# EAGLE design LilyPad-Simple-v25 (EAGLE 6.4)
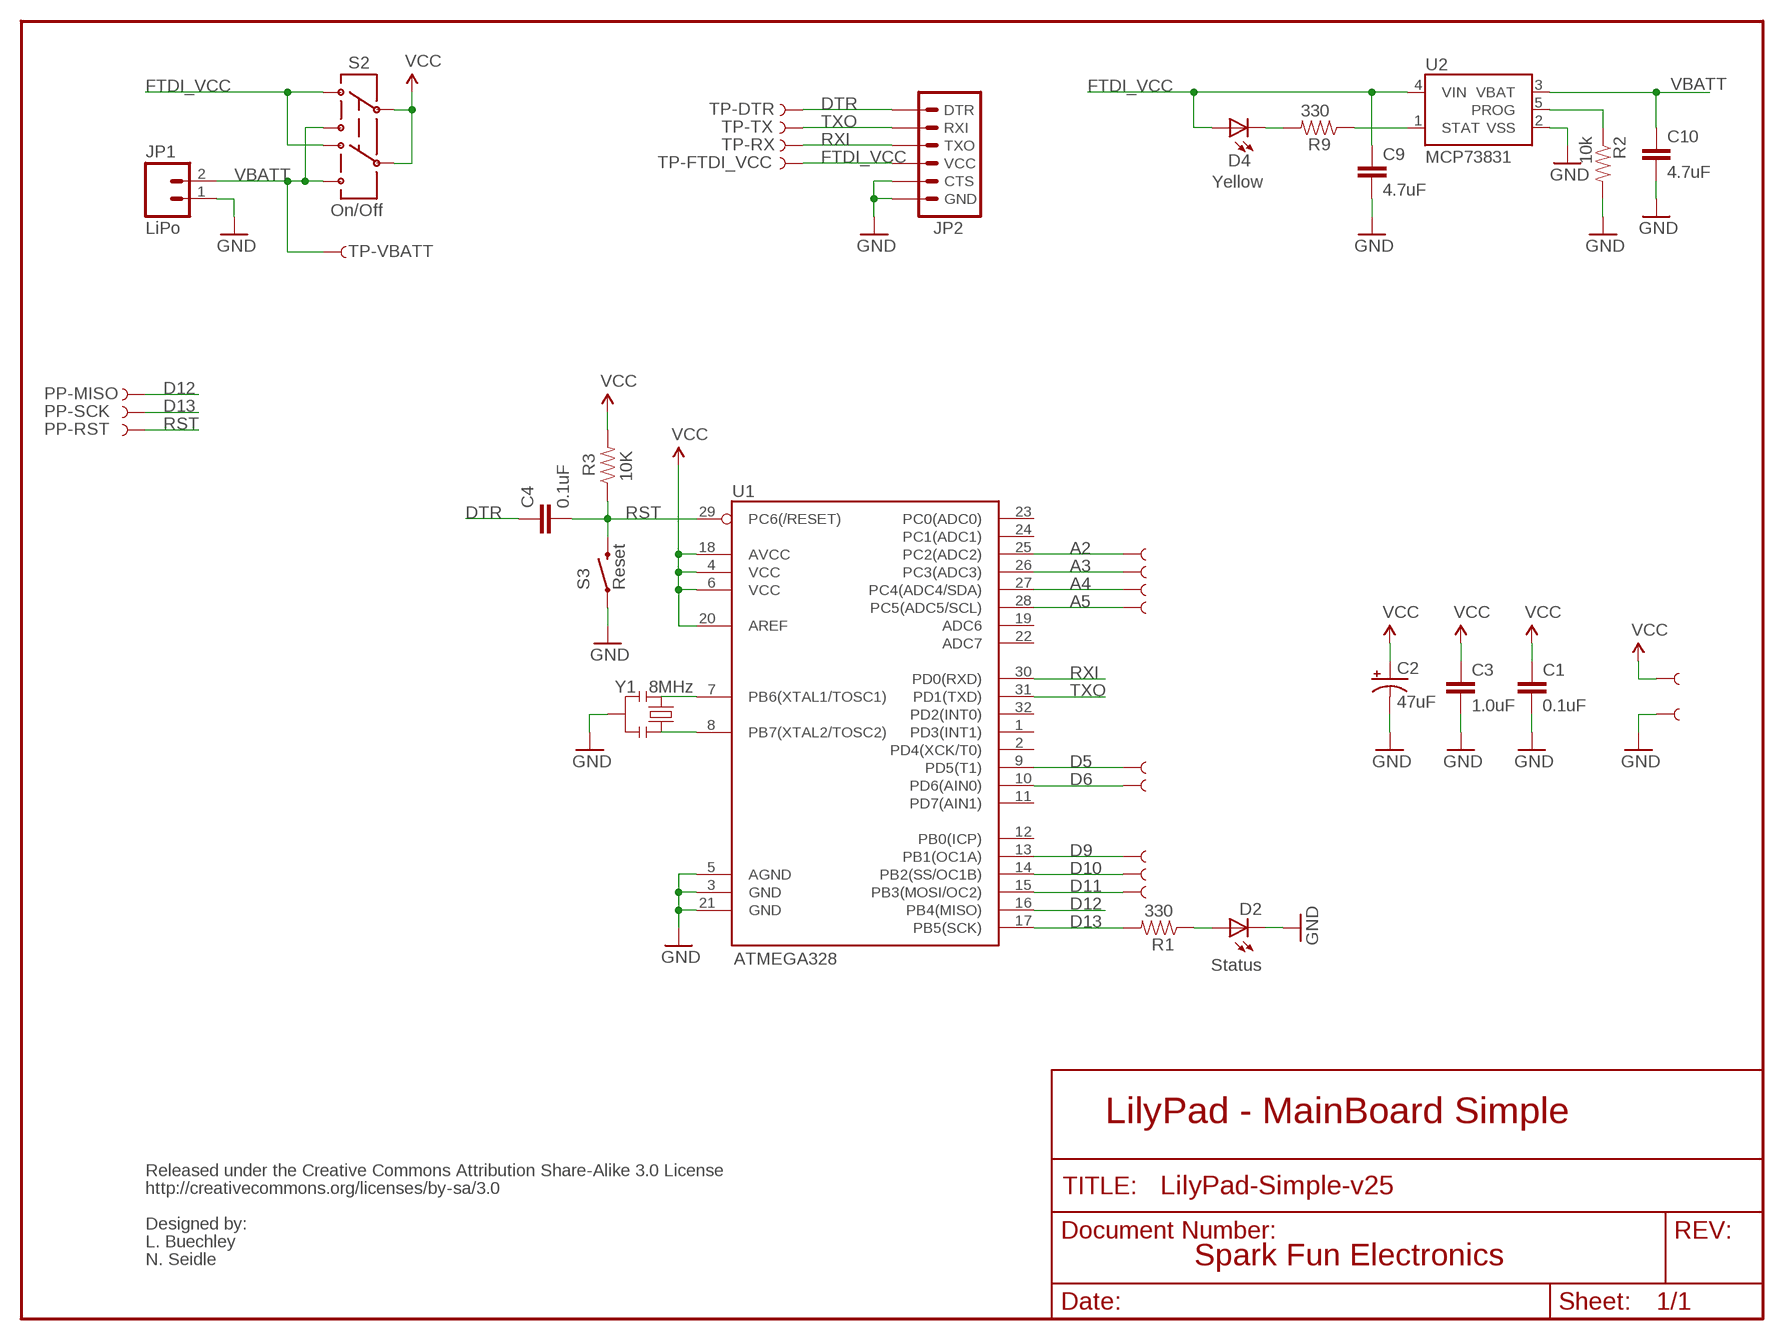
[diagram p0: schematic, sheet 1]

## Parts
A2/16  SEWTAP9  [PETAL-LONG-1-2SIDE]
A3/17  SEWTAP9  [PETAL-LONG-1-2SIDE]
A4/18  SEWTAP9  [PETAL-LONG-1-2SIDE]
A5/19  SEWTAP9  [PETAL-LONG-1-2SIDE]
C1  0.1uF  CAP0402-CAP  [0402-CAP]
C2  47uF  CAP_POL3528  [EIA3528]
C3  1.0uF  CAP0402-CAP  [0402-CAP]
C4  0.1uF  CAP0402-CAP  [0402-CAP]
C9  4.7uF  CAP0402-CAP  [0402-CAP]
C10  4.7uF  CAP0402-CAP  [0402-CAP]
D2  Status  LED0603  [LED-0603]
D4  Yellow  LED0603  [LED-0603]
JP1  LiPo  M02-JST-2MM-SMT  [JST-2-SMD]
JP2  ARDUINO_SERIAL_PROGRAMSMD  [1X06-SMD]
PP-MISO  TEST-POINT3X5  [PAD.03X.05]
PP-RST  TEST-POINT3X5  [PAD.03X.05]
PP-SCK  TEST-POINT3X5  [PAD.03X.05]
R1  330  RESISTOR0402-RES  [0402-RES]
R2  10k  RESISTOR0402-RES  [0402-RES]
R3  10K  RESISTOR0402-RES  [0402-RES]
R9  330  RESISTOR0402-RES  [0402-RES]
S2  On/Off  AYZ0202  [AYZ0202]
S3  Reset  SWITCH-MOMENTARY-2SMD  [TACTILE_SWITCH_SMD]
TP-DTR  TEST-POINT3X5  [PAD.03X.05]
TP-FTDI_VCC  TEST-POINT3X5  [PAD.03X.05]
TP-RX  TEST-POINT3X5  [PAD.03X.05]
TP-TX  TEST-POINT3X5  [PAD.03X.05]
TP-VBATT  TEST-POINT3X5  [PAD.03X.05]
U1  ATMEGA328  ATMEGA168  [TQFP32-08]
U2  MCP73831  [SOT23-5]
U$4  SEWTAP9  [PETAL-LONG-1-2SIDE]
U$35  SEWTAP9  [PETAL-LONG-1-2SIDE]
U$37  SEWTAP9  [PETAL-LONG-1-2SIDE]
U$39  SEWTAP9  [PETAL-LONG-1-2SIDE]
U$41  SEWTAP9  [PETAL-LONG-1-2SIDE]
U$43  SEWTAP9  [PETAL-LONG-1-2SIDE]
U$45  SEWTAP9  [PETAL-LONG-1-2SIDE]
Y1  8MHz  RESONATORSMD  [RESONATOR-SMD]

## Nets
A2: A2/16.1 U1.25(PC2(ADC2))
A3: A3/17.1 U1.26(PC3(ADC3))
A4: A4/18.1 U1.27(PC4(ADC4/SDA))
A5: A5/19.1 U1.28(PC5(ADC5/SCL))
D5: U1.9(PD5(T1)) U$41.1
D6: U1.10(PD6(AIN0)) U$35.1
D9: U1.13(PB1(OC1A)) U$37.1
D10: U1.14(PB2(SS/OC1B)) U$39.1
D11: U1.15(PB3(MOSI/OC2)) U$4.1
D12: PP-MISO.P$1 U1.16(PB4(MISO))
D13: PP-SCK.P$1 R1.2 U1.17(PB5(SCK))
DTR: C4.1 JP2.1(DTR) TP-DTR.P$1
FTDI_VCC: C9.1 D4.A JP2.4(VCC) S2.3 S2.6 TP-FTDI_VCC.P$1 U2.4(VIN)
GND [VCC]: C1.2 C2.C(-) C3.2 C9.2 C10.2 D2.C JP1.1 JP2.5(CTS) JP2.6(GND) R2.2 S3.1 U1.3(GND) U1.5(AGND) U1.21(GND) U2.2(VSS) U$43.1 Y1.2
N$1: U1.7(PB6(XTAL1/TOSC1)) Y1.1
N$2: D2.A R1.1
N$3: U1.8(PB7(XTAL2/TOSC2)) Y1.3
N$8: D4.C R9.2
PROG: R2.1 U2.5(PROG)
RST: C4.2 PP-RST.P$1 R3.1 S3.3 U1.29(PC6(/RESET))
RXI: JP2.3(TXO) TP-RX.P$1 U1.30(PD0(RXD))
STAT: R9.1 U2.1(STAT)
TXO: JP2.2(RXI) TP-TX.P$1 U1.31(PD1(TXD))
VBATT: C10.1 JP1.2 S2.1 S2.4 TP-VBATT.P$1 U2.3(VBAT)
VCC [VCC]: C1.1 C2.A(+) C3.1 R3.2 S2.2 S2.5 U1.4(VCC) U1.6(VCC) U1.18(AVCC) U1.20(AREF) U$45.1
Unconnected: U1.1(PD3(INT1)) U1.2(PD4(XCK/T0)) U1.11(PD7(AIN1)) U1.12(PB0(ICP)) U1.19(ADC6) U1.22(ADC7) U1.23(PC0(ADC0)) U1.24(PC1(ADC1)) U1.32(PD2(INT0))

## Notes on the sheet
- LilyPad - MainBoard Simple
- Released under the Creative Commons Attribution Share-Alike 3.0 License
- http://creativecommons.org/licenses/by-sa/3.0
- Designed by:
- L. Buechley
- N. Seidle | Spark Fun Electronics

## Library data of the parts
A2/16 A3/17 A4/18 A5/19 U$4 U$35 U$37 U$39 U$41 U$43 U$45 = LilyPad-Wearables:SEWTAP
C1 C3 C4 C9 C10 = SparkFun:CAP: Capacitor Standard 0603 ceramic capacitor, and 0.1" leaded capacitor.
C2 = SparkFun:CAP_POL: Capacitor Polarized These are standard SMD and PTH capacitors. Normally 10uF, 47uF, and 100uF in electrolytic and tantalum varieties. Always verify the external diameter of the through hole cap, it varies with capacity, voltage, and manufacturer. The EIA devices should be standard.
D2 D4 = SparkFun:LED: LEDs Standard schematic elements and footprints for 5mm, 3mm, 1206, and 0603 sized LEDs. 5mm - Spark Fun Electronics SKU : COM-00529 (and others)
JP1 = SparkFun:M02: Header 2 Standard 2-pin 0.1" header. Use with straight break away headers (SKU : PRT-00116), right angle break away headers (PRT-00553), swiss pins (PRT-00743), machine pins (PRT-00117), and female headers (PRT-00115). Molex polarized connector foot print use with SKU : PRT-08233 with associated crimp pins and housings.
JP2 = SparkFun:ARDUINO_SERIAL_PROGRAM
PP-MISO PP-RST PP-SCK TP-DTR TP-FTDI_VCC TP-RX TP-TX TP-VBATT = SparkFun:TEST-POINT
R1-R3 R9 = SparkFun:RESISTOR: Resistor Basic schematic elements and footprints for 0603, 1206, and PTH resistors.
S2 = SparkFun:AYZ0202: SPDT Slide Switch Simple SMD single-pull double-throw slide switch. Good for less than 350mA power switch, switching UARTs between devices, etc. Spark Fun Electronics SKU : COM-00597
S3 = SparkFun:SWITCH-MOMENTARY-2
U1 = SparkFun:ATMEGA168
U2 = SparkFun:MCP73831: Microchip's MCP73831 Miniature single cell, fully integrated Li-Ion, Li-polymer charge management controller http://ww1.microchip.com/downloads/en/DeviceDoc/21984a.pdf
Y1 = SparkFun:RESONATOR: Resonator Small SMD resonator. This is the itty bitty 10/20MHz resonators with built in caps. CSTCE10M0G55 and CSTCE20M0V53. Footprint has been reviewed closely but hasn't been tested yet.

## Net classes
0 Default: width 0.203 mm
1 VCC: width 0.254 mm

## Board
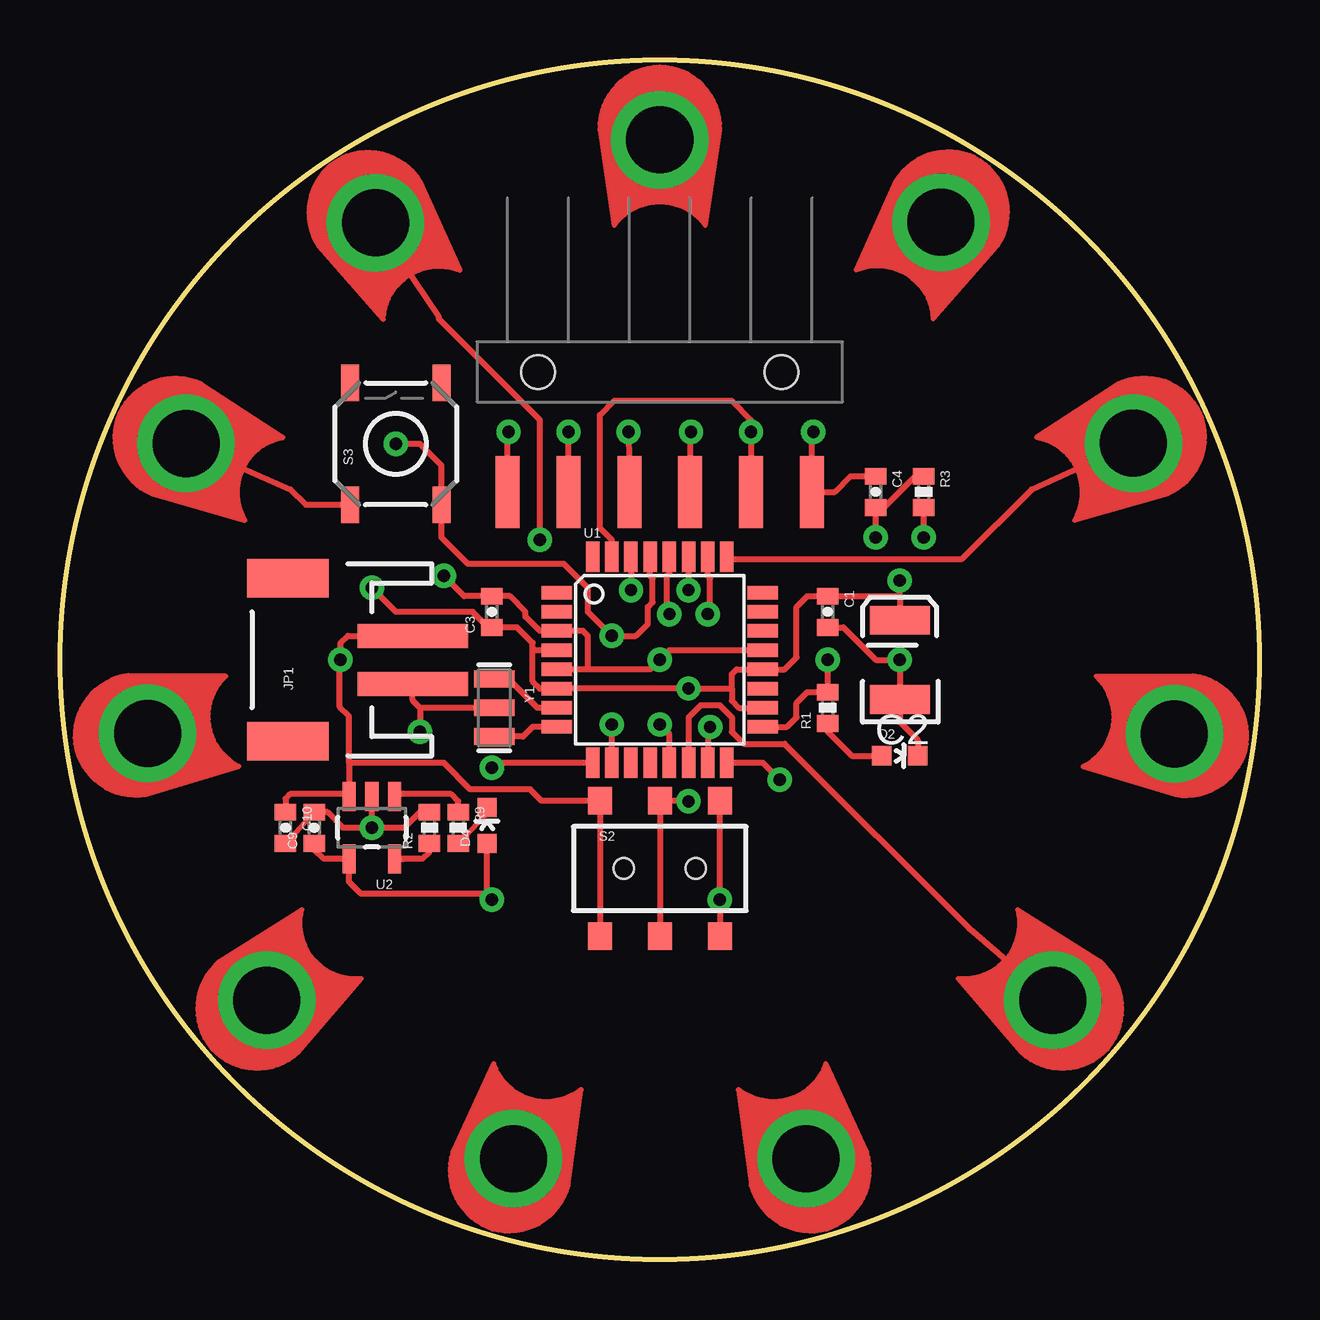
[diagram p1: board, top side]
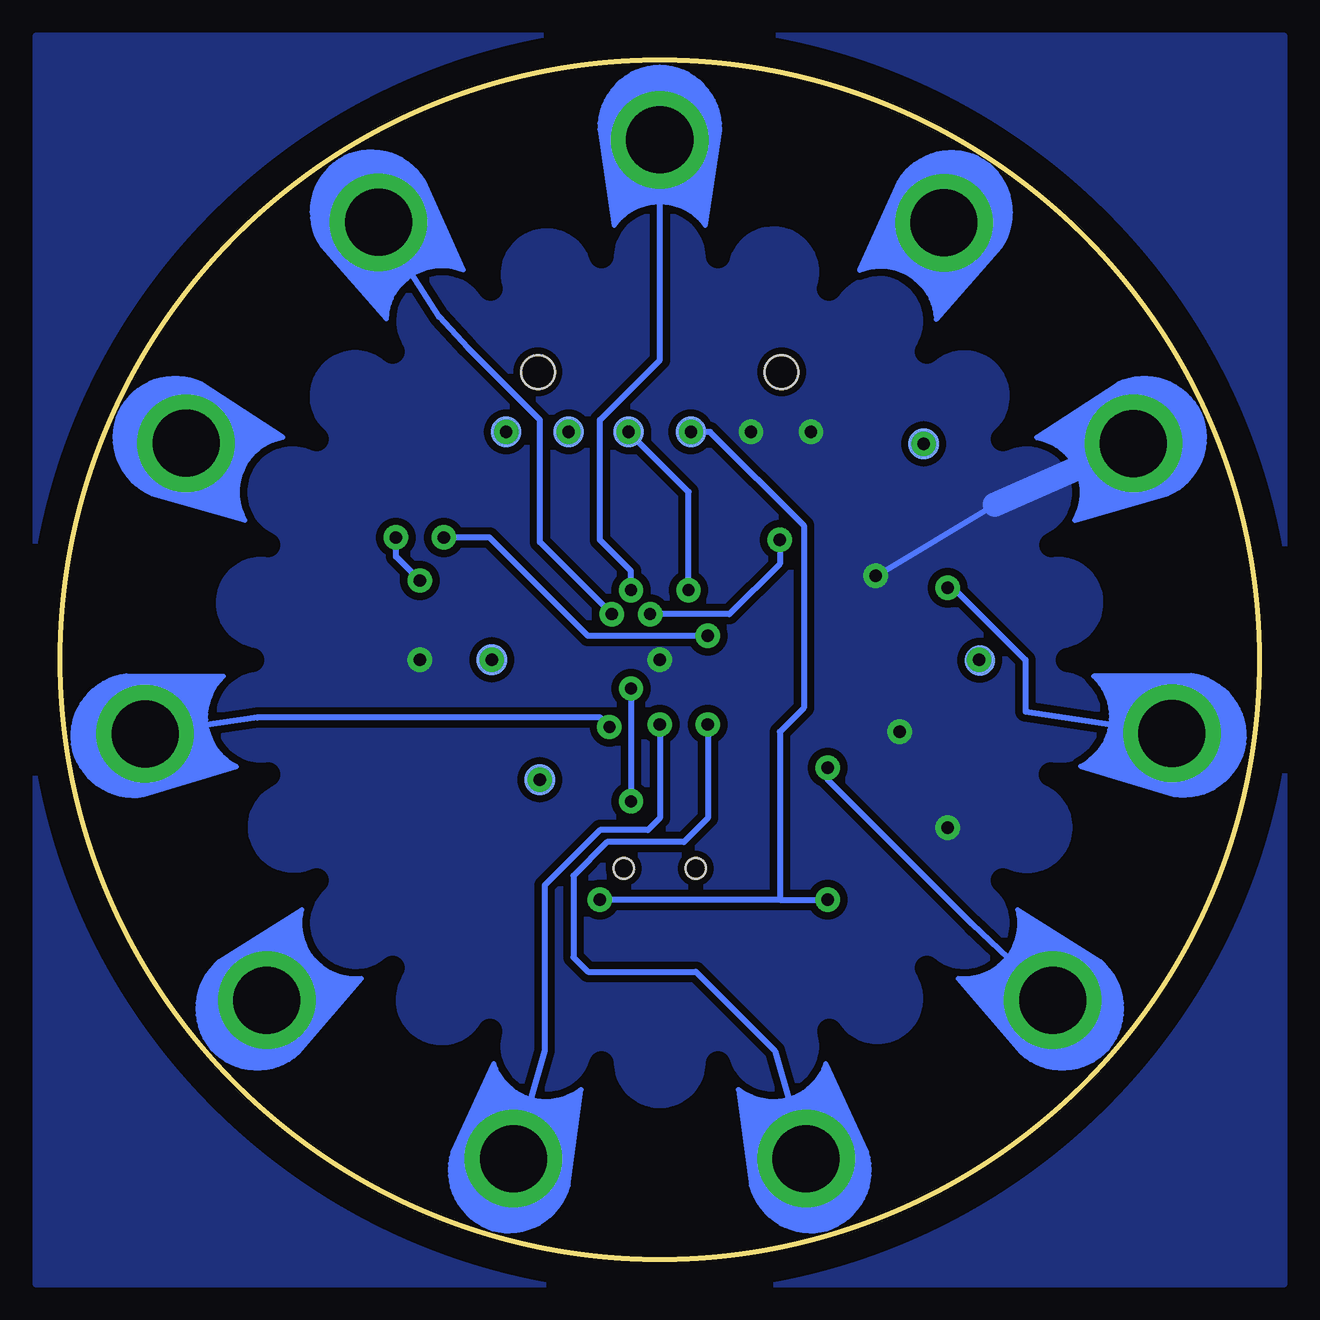
[diagram p2: board, bottom side, seen from below]

Size 50 x 50 mm. Coordinates in mm from the lower left corner, seen from the top.
Outline: circle at 25,25 radius 25
Copper layers (1*16): Top 0.035mm / dielectric 1.5mm / Bottom 0.035mm
Design rules "default": minimum track width 8mil, minimum drill 20mil, track to track 8mil, track to pad 8mil, pad to pad 8mil, via to via 8mil, smd to smd 8mil, copper to edge 8mil, drill to drill 8mil, minimum pad ring 12mil, minimum via ring 10mil, stop-mask expansion 4mil, vias tented up to drill 20mil, thermal gap 10mil
bRestrict: area 2.4,2.4 to 47.6,47.6; area 21,42.8 to 23.5,44; area 31.6,41.3 to 34.4,43; area 36.3,38.4 to 38.9,40.7; area 40,34.1 to 42,36.9; area 42.2,29.2 to 43.6,31.8; area 42.8,23.9 to 44,26.2; area 42.2,18.2 to 43.7,20.9; area 36.3,9.4 to 39,11.7; area 31.7,7 to 34.5,8.7; area 26.5,6 to 28.9,7.3; area 21.1,6 to 23.6,7.3; area 15.6,7 to 18.3,8.7; area 11,9.3 to 13.8,11.6; area 8,13.1 to 10.1,15.9; area 6.4,18.2 to 8,20.8; area 6,23.7 to 7.2,26.2; area 6.3,29.1 to 7.9,31.7; area 8,34 to 10.1,36.9; area 11,38.3 to 13.7,40.6; area 15.4,41.2 to 18.4,43; area 26.4,42.5 to 29.1,44; area 40,13 to 42,16.1; 22 lines

### Footprints (pad centres in the part's own frame; a part is rotated, then mirrored left to right if it is on the bottom)
PETAL-LONG-1-2SIDE = drill 2.794 pad 4.064: 1 0.03,0
0402-CAP = smd 0.7 x 0.9: 1 -0.65,0; 2 0.65,0
EIA3528 = smd 1.2 x 2.5: A 1.65,0; C -1.65,0
LED-0603 = smd 0.8 x 0.8: A 0,-0.75; C 0,0.75
JST-2-SMD = smd 1 x 4.6: 1 -1,-3.7; 2 1,-3.7 | smd 1.6 x 3.4: NC1 -3.4,1.5; NC2 3.4,1.5
1X06-SMD = smd 1 x 3: 1 -6.35,5; 2 -3.81,5; 3 -1.27,5; 4 1.27,5; 5 3.81,5; 6 6.35,5 | hole 1.4: -5.08,0; 5.08,0
PAD.03X.05 = smd 1.27 x 1.27: P$1 0,0
0402-RES = smd 0.7 x 0.9: 1 -0.65,0; 2 0.65,0
AYZ0202 = smd 1 x 1.15: 1 -2.5,2.825; 2 0,2.825; 3 2.5,2.825; 4 -2.5,-2.825; 5 0,-2.825; 6 2.5,-2.825 | hole 0.85: 1.5,0; -1.5,0
TACTILE_SWITCH_SMD = smd 1.524 x 0.762: 1 -2.54,1.905; 2 2.54,1.905; 3 -2.54,-1.905; 4 2.54,-1.905
TQFP32-08 = smd 1.27 x 0.559: 1 -4.293,2.8; 2 -4.293,2; 3 -4.293,1.2; 4 -4.293,0.4; 5 -4.293,-0.4; 6 -4.293,-1.2; 7 -4.293,-2; 8 -4.293,-2.8; 17 4.293,-2.8; 18 4.293,-2; 19 4.293,-1.2; 20 4.293,-0.4; 21 4.293,0.4; 22 4.293,1.2; 23 4.293,2; 24 4.293,2.8 | smd 0.559 x 1.27: 9 -2.8,-4.293; 10 -2,-4.293; 11 -1.2,-4.293; 12 -0.4,-4.293; 13 0.4,-4.293; 14 1.2,-4.293; 15 2,-4.293; 16 2.8,-4.293; 25 2.8,4.293; 26 2,4.293; 27 1.2,4.293; 28 0.4,4.293; 29 -0.4,4.293; 30 -1.2,4.293; 31 -2,4.293; 32 -2.8,4.293
SOT23-5 = smd 0.55 x 1.2: 1 -0.95,-1.3; 2 0,-1.3; 3 0.95,-1.3; 4 0.95,1.3; 5 -0.95,1.3
RESONATOR-SMD = smd 0.7 x 1.7: 1 -1.2,0; 2 0,0; 3 1.2,0

### Placement (x,y rotation side)
A2/16  44.77,34.04 204.5 top
A3/17  36.74,43.26 237.3 top
A4/18  25,46.7 270 top
A5/19  13.13,43.24 302.7 top
C1  32,27 270 top
C2  35,25 90 top
C3  18,27 90 top
C4  34,32 270 top
C9  10.6,18 90 top
C10  9.4,18 270 top
D2  35,21 270 top
D4  17.8,18.1 0 top
JP1  11,25 90 top
JP2  25,37 180 top
PP-MISO  30,20 0 bottom
PP-RST  14,34 0 bottom
PP-SCK  32,25 0 bottom
R1  32,23 90 top
R2  15.4,18 90 top
R3  36,32 270 top
R9  16.6,18 270 top
S2  25,16.3 0 top
S3  14,34 90 top
TP-DTR  31.4,34.5 0 bottom
TP-FTDI_VCC  23.7,34.5 0 bottom
TP-RX  26.3,34.5 0 bottom
TP-TX  28.8,34.5 90 bottom
TP-VBATT  11.66,24.97 0 bottom
U1  25,25 0 top
U2  13,18 180 top
U$4  46.48,21.91 171.8 top
U$35  18.89,4.17 73.7 top
U$37  31.11,4.17 106.3 top
U$39  41.4,10.79 139.1 top
U$41  8.6,10.79 40.9 top
U$43  5.23,34.03 335.5 top
U$45  3.62,21.92 8.2 top
Y1  18.1,23 270 top

### Tracks (layer width: path | path; a pad name or v marks a point on that pad's centre or on a via)
A2
  Top 0.254: A2/16.1 40.5,32.1 37.6,29.2 27.89,29.2 U1.25
A3  (via drill 0.51)
  Top 0.254: U1.26 27,28.5 27.1,28.4 27.1,27 v27,26.9
  Bottom 0.254: A3/17.1 34.2,39.3 33,38 30,35 30,29.9 v27,26.9
A4  (via drill 0.51)
  Top 0.254: U1.27 v26.2,27.9
  Bottom 0.254: v26.2,27.9 26.2,28.7 27.5,30 27.5,35 25,37.5 A4/18.1
A5  (via drill 0.51)
  Top 0.254: A5/19.1 15.8,39.3 15.8,39.2 20,35 v20,30 | U1.28 25.4,28.6 25.3,28.5 25.3,27 v25.4,26.9
  Bottom 0.254: v20,30 20,29 22.1,26.9 v25.4,26.9
D5  (via drill 0.51)
  Top 0.254: U1.9 18.21,20.71 v18,20.5
  Bottom 0.254: U$41.1 12,14 18,20 v18,20.5
D6  (via drill 0.51)
  Top 0.254: U1.10 v23,22.3
  Bottom 0.254: v23,22.3 23,18.4 24,17.4 27.2,17.4 28.6,16 28.6,12.6 28,12 23.5,12 20.2,8.7 U$35.1
D9  (via drill 0.51)
  Top 0.254: U1.13 25.4,21.9 v25,22.3
  Bottom 0.254: v25,22.3 25,18.4 25.5,17.9 27.5,17.9 29.8,15.6 29.8,8.7 U$37.1
D10
  Top 0.254: U$39.1 37.9,13.8 30.2,21.5 28.5,21.5 28,22 28,22.6 27.5,23.1 26.7,23.1 26.2,22.6 U1.14
D11  (via drill 0.51)
  Top 0.254: U1.15 27,22.1 v27.1,22.2
  Bottom 0.254: v27.1,22.2 27.5,22.6 41.76,22.6 41.76,22.59 U$4.1
D12  (via drill 0.51)
  Top 0.254: U1.16 29.29,20.71 PP-MISO.P$1
  other vias: 30,20
D13  (via drill 0.51)
  Top 0.254: PP-SCK.P$1 R1.2 31.15,23.65 30.7,23.2 30.7,22.6 30.3,22.2 U1.17
  other vias: 32,25
DTR  (via drill 0.51)
  Top 0.254: TP-DTR.P$1 31.35,34.45 JP2.1 32.3,32 32.95,32.65 C4.1
  other vias: 31.4,34.5
FTDI_VCC  (via drill 0.51)
  Top 0.254: S2.3 v27.5,15 S2.6 | U2.4 12.05,15.75 12.55,15.25 17.75,15.25 v18,15 17.8,15.2 D4.A | C9.1 10.6,17.1 11,16.7 U2.4 | U2.4 | TP-FTDI_VCC.P$1 JP2.4
  Bottom 0.254: 20,15 v18,15 | 20,15 v27.5,15 | 20,15 20,22 19,23 19,30.6 22.9,34.5 TP-FTDI_VCC.P$1
  other vias: 23.7,34.5
GND  (via drill 0.51)
  Top 0.203: C9.2 C10.2
  Top 0.254: U1.21 25.4,25.4 v25,25 24.6,24.6 22,24.6 | 22,24.6 U1.5 | 22,24.6 22,26 21.8,26.2 U1.3 20,26.2 19.4,26.8 19.4,27 18.75,27.65 C3.2 16.85,27.65 v16,28.5 | U$43.1 9.6,32.1 10.24,31.46 S3.1 | v13,18 U2.2 | C1.2 32.65,26.35 34,25 v35,25 C2.C 35,22.4 35.75,21.65 D2.C | v13,18 14.35,18 15,18.65 R2.2 | C9.2 11.15,18.65 11.8,18 v13,18 | Y1.2 15,23 | JP1.1 14.7,23.3 15,23 | 15,23 v15,22 | JP2.6 18.65,34.45 v18.7,34.5 | JP2.5 v21.19,34.49 v21.2,34.5
  Bottom 0.254: v16,28.5 11.03,31.46
  Bottom 1.016: 11.03,31.46 U$43.1
  pour Bottom (isolate 0.305): -1,51 51,51 51,-1 -1,-1
N$1
  Top 0.254: U1.7 19.9,23 18.7,24.2 Y1.1
N$2
  Top 0.254: R1.1 32,22 33,21 D2.A
N$3
  Top 0.254: U1.8 19.7,22.2 19.3,21.8 Y1.3
N$8
  Top 0.203: R9.2 17.5,18.3 17.8,18.6 D4.C
PROG
  Top 0.254: U2.5 14.35,16.7 | R2.1 15.4,17 15.1,16.7 U2.5 | U2.5
RST  (via drill 0.51)
  Top 0.254: v34,30.1 C4.2 34.35,31.35 35.65,32.65 R3.1 | U1.29 24.6,28.5 24.7,28.4 24.7,27.4 24.5,27.2 24.5,26.5 24,26 v23,26 22,27 22,28 21,29 17,29 15.9,30.09 S3.3 15.9,33.09 15,34 PP-RST.P$1
  Bottom 0.254: v23,26 28,26 32.1,30.1 v34,30.1
  other vias: 14,34
RXI  (via drill 0.51)
  Top 0.254: U1.30 v23.8,27.9 | JP2.3 26.27,34.47 TP-RX.P$1
  Bottom 0.254: v23.8,27.9 23.8,32 TP-RX.P$1
  other vias: 26.3,34.5
STAT
  Top 0.254: R9.1 16.6,19.1 16.3,19.4 14.05,19.4 U2.1
TXO  (via drill 0.51)
  Top 0.254: U1.31 23,30 22.5,30.5 22.5,35.2 23.1,35.8 28,35.8 28.8,35 TP-TX.P$1 JP2.2
  other vias: 28.8,34.5
VBATT  (via drill 0.51)
  Top 0.254: S2.4 S2.1 20.07,19.12 19.6,19.6 17.1,19.6 16,20.7 12.05,20.7 | JP1.2 12,26 11.7,25.7 | C10.1 9.4,19.2 9.6,19.4 11.95,19.4 U2.3 12.05,20.7 | 12.05,20.7 12.05,22.65 11.66,23.04 TP-VBATT.P$1 v11.69,25 | v11.69,25 v11.7,25.01 11.7,25.7 | 11.7,25.7 11.69,25.69 v11.69,25
  Bottom 0.254: 11.66,25 v11.69,25 TP-VBATT.P$1
VCC  (via drill 0.51)
  Top 0.254: 19.7,25.5 19.7,24.1 20,23.8 U1.6 v26.2,23.8 28,23.8 | 19.7,25.5 19.7,25.7 19.05,26.35 C3.1 17.85,26.35 17.2,27 14,27 v13,28 | U1.4 19.8,25.4 19.7,25.5 | S2.5 S2.2 26.18,19.12 v26.2,19.1 | 35,27.6 C2.A | 35,27.6 v35,28.3 | 35,27.6 34.95,27.65 C1.1 31.15,27.65 30.7,27.2 30.7,25.1 30.2,24.6 U1.20 28.2,24.6 28,24.4 28,23.8 | v36,30.1 R3.2 | U1.18 28.3,23 28,23.3 28,23.8
  Bottom 0.254: v26.2,23.8 v26.2,19.1 | v36,30.1 36,29.3 v35,28.3 | v13,28 12.76,28 9.76,25 9.76,22.84 U$45.1

### Text on the board
tValues: Green